# EAGLE design 16296 (EAGLE 7.6.0)
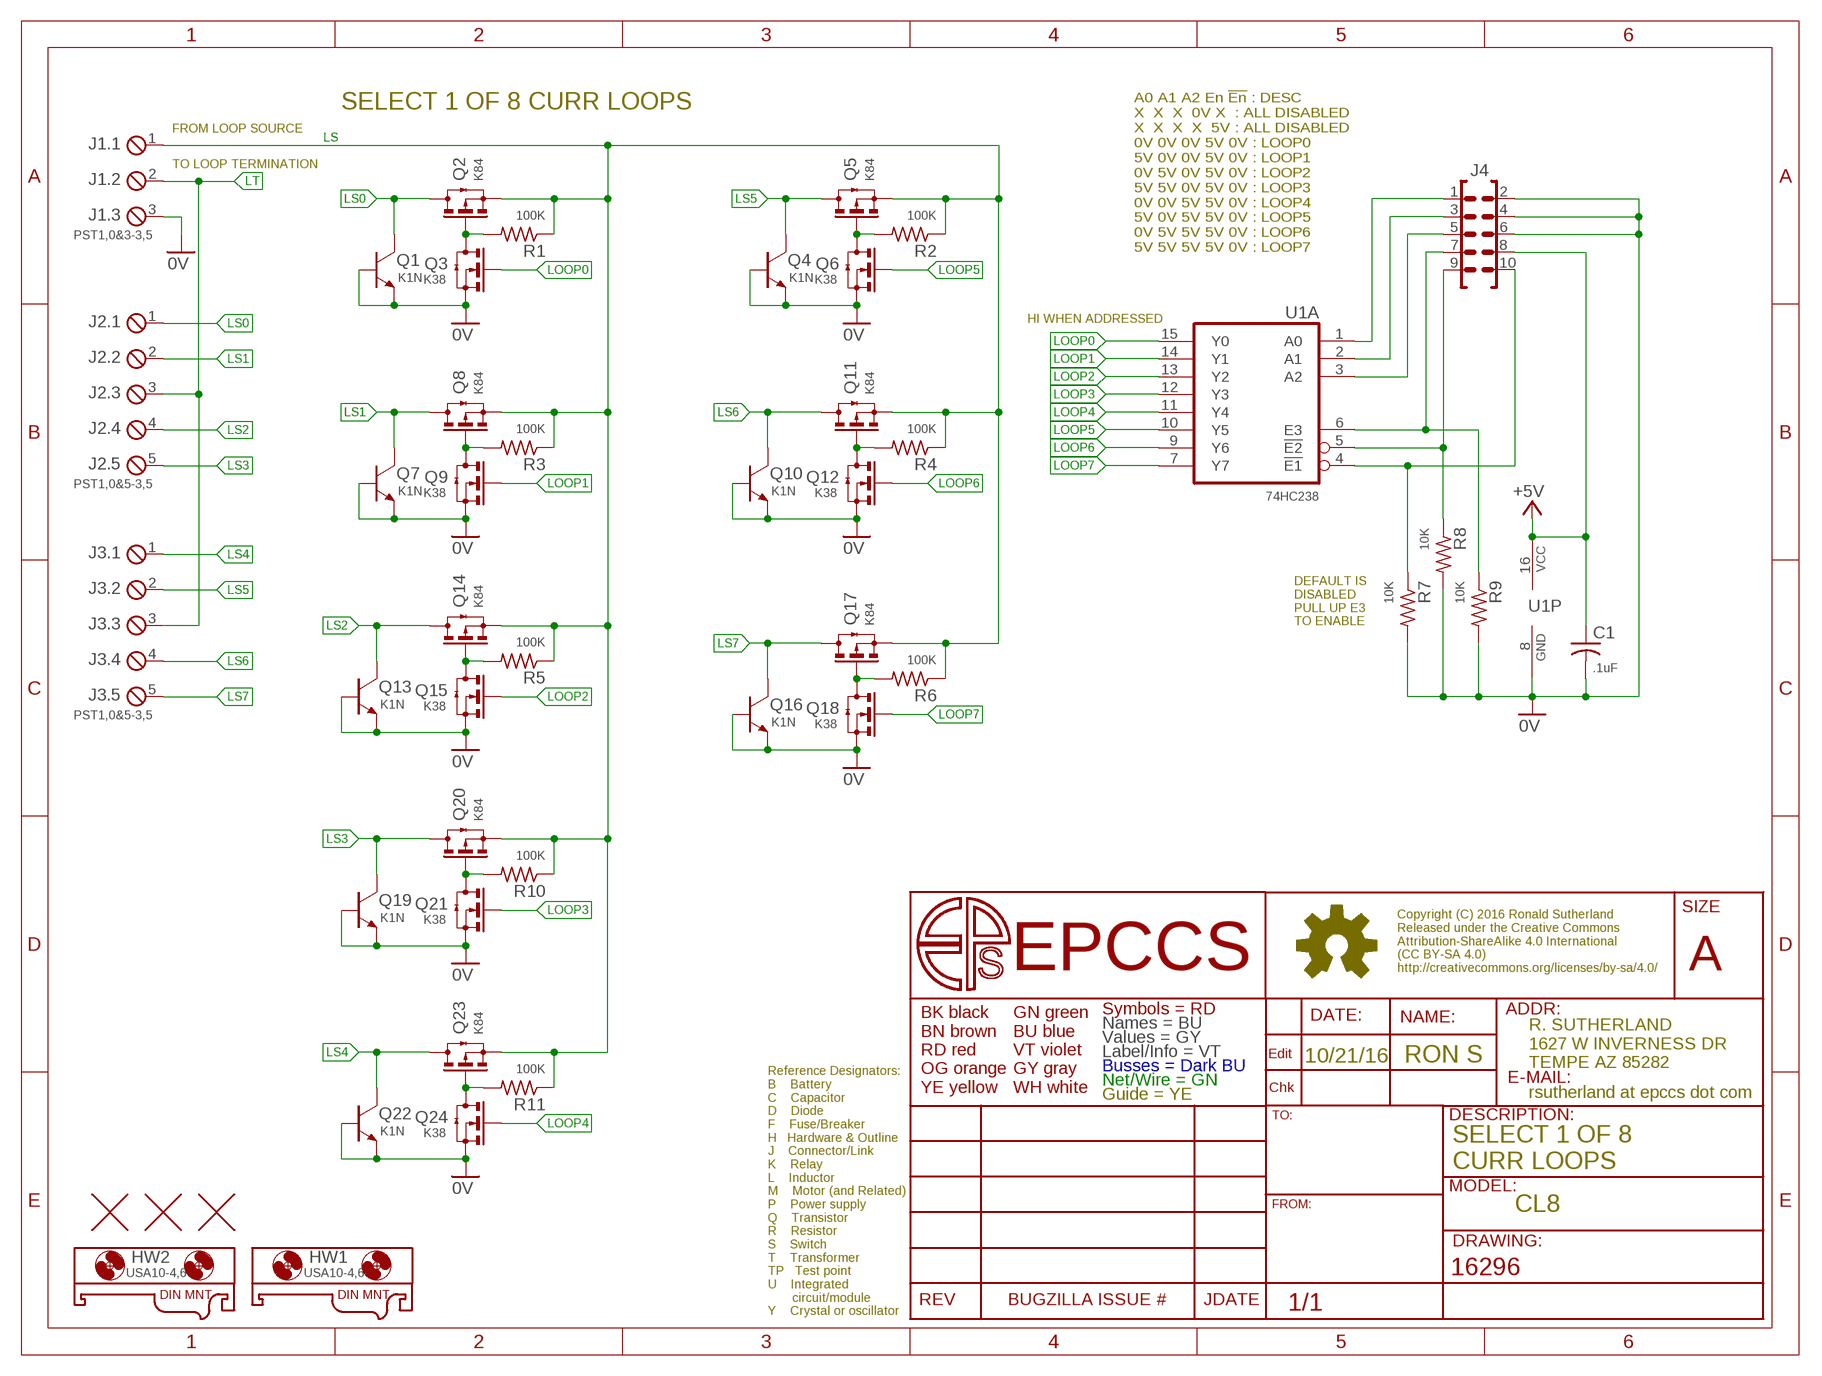
[diagram p0: schematic, sheet 1]

## Parts
C1  .1uF  CC0603A  [C0603(1608)]
HW1  USA10-4,6  MOUNT-HOLE5.0  [USA10]
HW2  USA10-4,6  MOUNT-HOLE5.0  [USA10]
J1  PST1,0&3-3,5  MCV3  [MCV3]
J2  PST1,0&5-3,5  MCV5  [MCV5]
J3  PST1,0&5-3,5  MCV5  [MCV5]
J4  2X5  [2X5]
Q1  K1N  NPNSOT23  [SOT23]
Q2  K84  N-CHSOT23  [SOT23]
Q3  K38  N-CHSOT23  [SOT23]
Q4  K1N  NPNSOT23  [SOT23]
Q5  K84  N-CHSOT23  [SOT23]
Q6  K38  N-CHSOT23  [SOT23]
Q7  K1N  NPNSOT23  [SOT23]
Q8  K84  N-CHSOT23  [SOT23]
Q9  K38  N-CHSOT23  [SOT23]
Q10  K1N  NPNSOT23  [SOT23]
Q11  K84  N-CHSOT23  [SOT23]
Q12  K38  N-CHSOT23  [SOT23]
Q13  K1N  NPNSOT23  [SOT23]
Q14  K84  N-CHSOT23  [SOT23]
Q15  K38  N-CHSOT23  [SOT23]
Q16  K1N  NPNSOT23  [SOT23]
Q17  K84  N-CHSOT23  [SOT23]
Q18  K38  N-CHSOT23  [SOT23]
Q19  K1N  NPNSOT23  [SOT23]
Q20  K84  N-CHSOT23  [SOT23]
Q21  K38  N-CHSOT23  [SOT23]
Q22  K1N  NPNSOT23  [SOT23]
Q23  K84  N-CHSOT23  [SOT23]
Q24  K38  N-CHSOT23  [SOT23]
R1  100K  R0805  [C0805(2012)]
R2  100K  R0805  [C0805(2012)]
R3  100K  R0805  [C0805(2012)]
R4  100K  R0805  [C0805(2012)]
R5  100K  R0805  [C0805(2012)]
R6  100K  R0805  [C0805(2012)]
R7  10K  R0805  [C0805(2012)]
R8  10K  R0805  [C0805(2012)]
R9  10K  R0805  [C0805(2012)]
R10  100K  R0805  [C0805(2012)]
R11  100K  R0805  [C0805(2012)]
U1  74HC238  74238D  [16SOIC]
U$2  FIDUCIAL1.27  [FIDUCIAL-1.27]
U$3  FIDUCIAL1.27  [FIDUCIAL-1.27]
U$4  FIDUCIAL1.27  [FIDUCIAL-1.27]

## Nets
0V: C1.2 J1.3 J4.2 J4.4 J4.6 Q1.B Q1.E Q3.2(S)(S) Q4.B Q4.E Q6.2(S)(S) Q7.B Q7.E Q9.2(S)(S) Q10.B Q10.E Q12.2(S)(S) Q13.B Q13.E Q15.2(S)(S) Q16.B Q16.E Q18.2(S)(S) Q19.B Q19.E Q21.2(S)(S) Q22.B Q22.E Q24.2(S)(S) R7.2 R8.2 R9.2 U1.8(P:GND)
!E1: J4.10 R7.1 U1.4(A:!E1)
!E2: J4.9 R8.1 U1.5(A:!E2)
+5V: C1.1 J4.8 U1.16(P:VCC)
A0: J4.1 U1.1(A:A0)
A1: J4.3 U1.2(A:A1)
A2: J4.5 U1.3(A:A2)
E3: J4.7 R9.1 U1.6(A:E3)
LOOP0: Q3.1(G)(G) U1.15(A:Y0)
LOOP1: Q9.1(G)(G) U1.14(A:Y1)
LOOP2: Q15.1(G)(G) U1.13(A:Y2)
LOOP3: Q21.1(G)(G) U1.12(A:Y3)
LOOP4: Q24.1(G)(G) U1.11(A:Y4)
LOOP5: Q6.1(G)(G) U1.10(A:Y5)
LOOP6: Q12.1(G)(G) U1.9(A:Y6)
LOOP7: Q18.1(G)(G) U1.7(A:Y7)
LS: J1.1 Q2.2(S)(S) Q5.2(S)(S) Q8.2(S)(S) Q11.2(S)(S) Q14.2(S)(S) Q17.2(S)(S) Q20.2(S)(S) Q23.2(S)(S) R1.1 R2.1 R3.1 R4.1 R5.1 R6.1 R10.1 R11.1
LS0: J2.1 Q1.C Q2.3(D)(D)
LS1: J2.2 Q7.C Q8.3(D)(D)
LS2: J2.4 Q13.C Q14.3(D)(D)
LS3: J2.5 Q19.C Q20.3(D)(D)
LS4: J3.1 Q22.C Q23.3(D)(D)
LS5: J3.2 Q4.C Q5.3(D)(D)
LS6: J3.4 Q10.C Q11.3(D)(D)
LS7: J3.5 Q16.C Q17.3(D)(D)
LT: J1.2 J2.3 J3.3
N$1: Q5.1(G)(G) Q6.3(D)(D) R2.2
N$2: Q8.1(G)(G) Q9.3(D)(D) R3.2
N$3: Q11.1(G)(G) Q12.3(D)(D) R4.2
N$4: Q14.1(G)(G) Q15.3(D)(D) R5.2
N$5: Q17.1(G)(G) Q18.3(D)(D) R6.2
N$6: Q20.1(G)(G) Q21.3(D)(D) R10.2
N$7: Q23.1(G)(G) Q24.3(D)(D) R11.2
N$78: Q2.1(G)(G) Q3.3(D)(D) R1.2

## Notes on the sheet
- SELECT 1 OF 8 CURR LOOPS
- FROM LOOP SOURCE
- TO LOOP TERMINATION
- A0 A1 A2 En !En! : DESC
  X  X  X  0V X  : ALL DISABLED
  X  X  X  X  5V : ALL DISABLED
  0V 0V 0V 5V 0V : LOOP0
  5V 0V 0V 5V 0V : LOOP1
  0V 5V 0V 5V 0V : LOOP2
  5V 5V 0V 5V 0V : LOOP3
  0V 0V 5V 5V 0V : LOOP4
  5V 0V 5V 5V 0V : LOOP5
  0V 5V 5V 5V 0V : LOOP6
  5V 5V 5V 5V 0V : LOOP7
- HI WHEN ADDRESSED
- DEFAULT IS
  DISABLED
  PULL UP E3
  TO ENABLE
- 10/21/16 | RON S
- SELECT 1 OF 8 
  CURR LOOPS
- CL8

## Library data of the parts
C1 = C-C:C: CAPACITOR Symbol
HW1 HW2 = HW-DINMnt:MOUNT-HOLE: USA10-4.6 [PhxCont,1202713] DINRAIL ADAPTER UNIVERSAL 10MM 4.6MM
J1 = J-HDR3.5mm:MCV3: MCV 1,5/ 3-G-3,5-RN [PHOENIX CONTACT,1731484] CONN HEADER SHROUDED 3POS 3.5MM MCVR 1,5/ 3-ST-3,5 [PHOENIX CONTACT,1863165] CONN PLUG 3POS SCREW 3.5MM PST 1,0/3-3,5 [PHOENIX CONTACT,1945106] CONN HEADER STRIP PIN 3POS 3.5MM PT1,5&3-PVH-3,5 [PHOENIX CONTACT,1984028] CONN PLUG STRIP 3POS 3.5MM
J2 J3 = J-HDR3.5mm:MCV5: MCV 1,5/5-G-3,5-RN [PHOENIX CONTACT,1843635] CONN HEADER SHROUDED 5POS 3.5MM MCVR 1,5/5-ST-3,5 [PHOENIX CONTACT,1863181] CONN PLUG 5POS SCREW 3.5MM PST 1,0/5-3,5 [PHOENIX CONTACT,1945122] CONN HEADER STRIP PIN 5POS 3.5MM PT 1,5/5-PVH-3,5 [PHOENIX CONTACT,1984044] CONN PLUG STRIP 4POS 3.5MM Drill Size 3/64": .0469" (1.2mm)
J4 = J-HDR2.54mm:2X5: 2 X 5 POS HEADER
Q1 Q4 Q7 Q10 Q13 Q16 Q19 Q22 = Q-NPN:NPN: BJT NPN General Purpose Amplifier
Q2 Q5 Q8 Q11 Q14 Q17 Q20 Q23 = Q-PCH:N-CH?*: ENHANCEMENT MODE MOSFET SOT23 is BSS138 pinout
Q3 Q6 Q9 Q12 Q15 Q18 Q21 Q24 = Q-NCH:N-CH?*: ENHANCEMENT MODE MOSFET SOT23 is BSS138 pinout
R1-R11 = R-C:R: Resiistor American-style symbol
U1 = U-7400:74*238: non-Inverting Logic 3- to 8-Line Decoder/Demultiplexer see 74138 for Inverting
U$2-U$4 = H-Fiducial:FIDUCIAL: Fiducial Alignment Points Various fiducial points for machine vision alignment.

## Net classes
0 default: width 0.254 mm, drill 0.33 mm

## Board
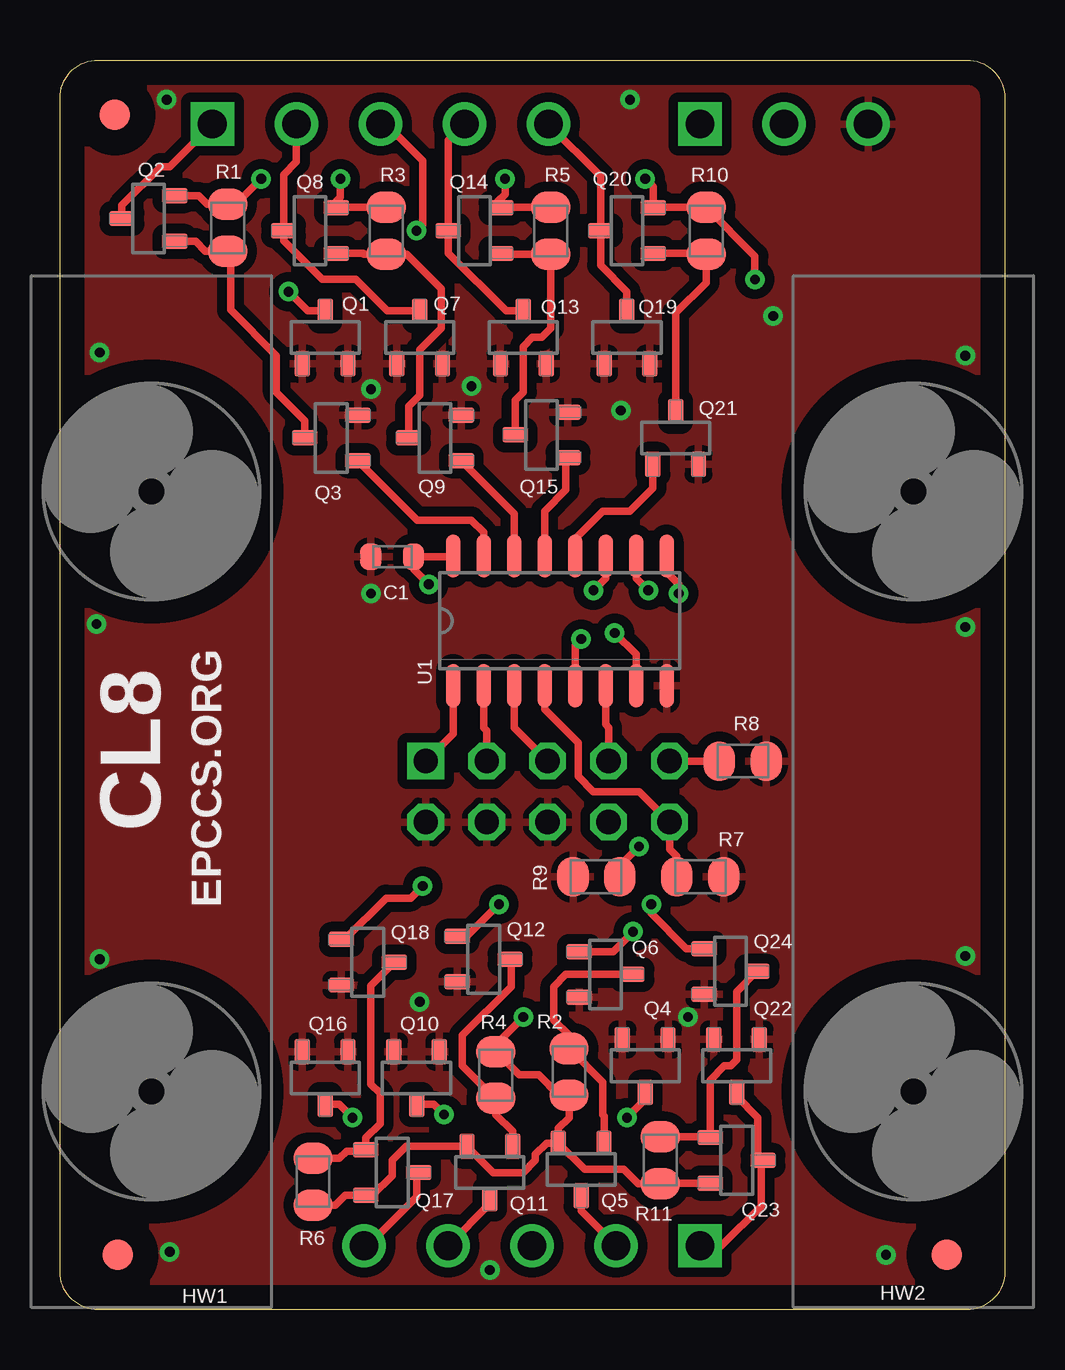
[diagram p1: board, top side]
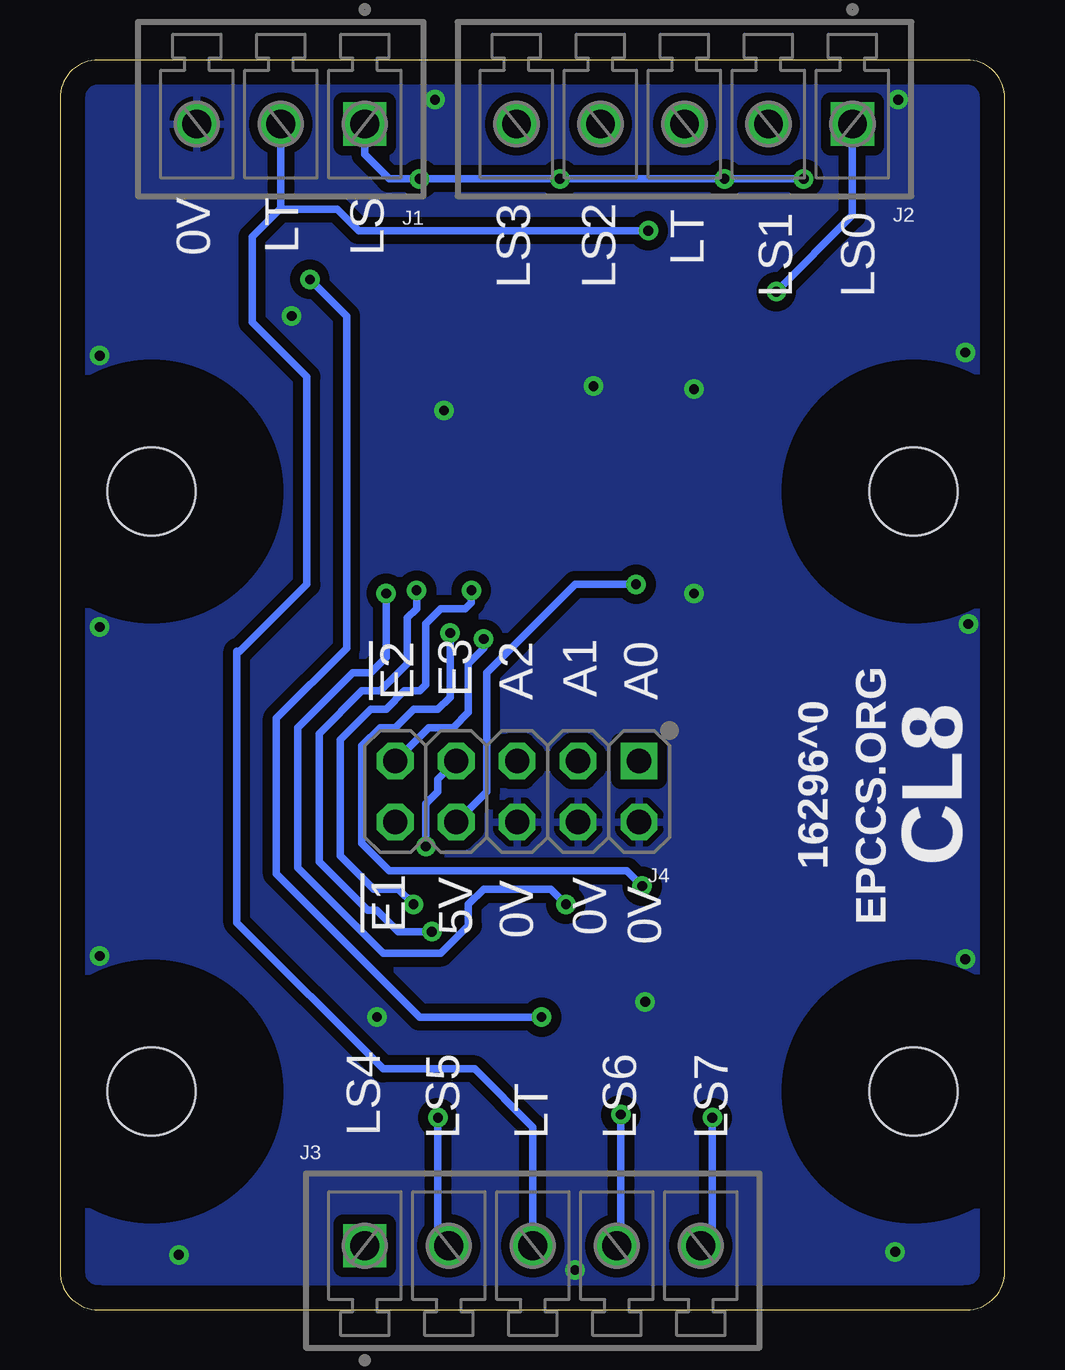
[diagram p2: board, bottom side, seen from below]

Size 39.37 x 52.07 mm. Coordinates in mm from the lower left corner, seen from the top.
Outline: 39.37,50.48 39.37,1.59 arc-90 37.78,0 1.59,0 arc-90 0,1.59 0,50.48 arc-90 1.59,52.07 37.78,52.07 arc-90 39.37,50.48
Copper layers (1*16): Top 0.034290625mm / dielectric 60mil / Bottom 0.034290625mm
Design rules "default *": minimum track width 10mil, minimum drill 13mil, track to track 12mil, track to pad 10mil, pad to pad 8mil, via to via 12mil, smd to smd 8mil, copper to edge 40mil, drill to drill 16mil, minimum pad ring 10mil, minimum via ring 8mil, stop-mask expansion 4mil, vias tented up to drill 17mil, thermal gap 10mil

### Footprints (pad centres in the part's own frame; a part is rotated, then mirrored left to right if it is on the bottom)
C0603(1608) = smd 0.898 x 1.1: 1 -0.889,0; 2 0.889,0
USA10 = hole 3.658: -12.5,0; 12.5,0
MCV3 = drill 1.2 square: 1 0,0 | drill 1.2: 2 3.5,0; 3 7,0
MCV5 = drill 1.2 square: 1 0,0 | drill 1.2: 2 3.5,0; 3 7,0; 4 10.5,0; 5 14,0
2X5 = drill 1.016 square: 1 0,0 | drill 1.016 octagon: 2 0,2.54; 3 2.54,0; 4 2.54,2.54; 5 5.08,0; 6 5.08,2.54; 7 7.62,0; 8 7.62,2.54; 9 10.16,0; 10 10.16,2.54
SOT23 = smd 0.65 x 1.06: B -0.95,-1.1; C 0,1.1; E 0.95,-1.1
SOT23' = smd 0.65 x 1.06: 1(G) -0.95,-1.1; 2(S) 0.95,-1.1; 3(D) 0,1.1
C0805(2012) = smd 1.321 x 1.651: 1 -0.977,0; 2 0.977,0
16SOIC = smd 0.6 x 1.8: 1 -4.445,-2.7; 2 -3.175,-2.7; 3 -1.905,-2.7; 4 -0.635,-2.7; 5 0.635,-2.7; 6 1.905,-2.7; 7 3.175,-2.7; 8 4.445,-2.7; 9 4.445,2.7; 10 3.175,2.7; 11 1.905,2.7; 12 0.635,2.7; 13 -0.635,2.7; 14 -1.905,2.7; 15 -3.175,2.7; 16 -4.445,2.7
FIDUCIAL-1.27 = smd 1.27 x 1.27: 1 0,0

### Placement (x,y rotation side)
C1  13.84,31.37 180 top
HW1  3.81,21.59 90 top
HW2  35.56,21.59 90 top
J1  26.67,49.4 180 bottom
J2  6.35,49.4 180 bottom
J3  26.67,2.67 0 bottom
J4  15.24,22.86 180 bottom
Q1  11.05,40.51 0 top
Q2  K84  [SOT23']  3.68,45.47 90 top
Q3  K38  [SOT23']  11.3,36.32 90 top
Q4  24.38,10.16 180 top
Q5  K84  [SOT23']  21.72,5.84 180 top
Q6  K38  [SOT23']  22.73,13.97 270 top
Q7  14.99,40.51 0 top
Q8  K84  [SOT23']  10.41,44.96 90 top
Q9  K38  [SOT23']  15.62,36.32 90 top
Q10  14.86,9.65 180 top
Q11  K84  [SOT23']  17.91,5.71 180 top
Q12  K38  [SOT23']  17.65,14.61 270 top
Q13  19.3,40.51 0 top
Q14  K84  [SOT23']  17.27,44.96 90 top
Q15  K38  [SOT23']  20.07,36.45 90 top
Q16  11.05,9.65 180 top
Q17  K84  [SOT23']  13.84,5.71 270 top
Q18  K38  [SOT23']  12.83,14.48 270 top
Q19  23.62,40.51 0 top
Q20  K84  [SOT23']  23.62,44.96 90 top
Q21  K38  [SOT23']  25.65,36.32 0 top
Q22  28.19,10.16 180 top
Q23  K84  [SOT23']  28.19,6.22 270 top
Q24  K38  [SOT23']  27.94,14.1 270 top
R1  6.99,45.09 270 top
R2  21.21,9.91 90 top
R3  13.59,44.96 270 top
R4  18.16,9.78 270 top
R5  20.45,44.96 270 top
R6  10.54,5.33 90 top
R7  26.67,18.03 0 top
R8  28.45,22.86 0 top
R9  22.35,18.03 180 top
R10  26.92,44.96 270 top
R11  25.02,6.22 90 top
U1  20.83,28.7 0 top
U$2  36.96,2.29 0 top
U$3  2.29,49.78 0 top
U$4  2.41,2.29 0 top

### Tracks (layer width: path | path; a pad name or v marks a point on that pad's centre or on a via)
0V  (via drill 0.41)
  other vias: 12.95,29.84 1.65,39.88 4.45,50.42 23.75,50.42 37.72,39.75 29.72,41.4 23.37,37.47 17.14,38.48 12.95,38.35 1.52,28.57 1.65,14.61 4.57,2.41 17.91,1.65 34.42,2.29 37.72,14.73 37.72,28.45 26.16,12.19 14.99,12.83
  pour Bottom (isolate 0.406): 0,52.07 39.37,52.07 39.37,0 0,0
  pour Top (isolate 0.406, rank 6): 0,52.07 39.37,52.07 39.37,0 0,0
!E1
  Top 0.305: U1.4 20.19,25.02 21.59,23.62 21.59,22.23 22.23,21.59 24.13,21.59 J4.10 25.4,19.18 25.69,18.88 R7.1
!E2  (via drill 0.41)
  Top 0.305: U1.5 21.46,27.69 v21.72,27.94 | R8.1 J4.9
  Bottom 0.305: v21.72,27.94 21.72,27.56 22.35,26.92 22.35,24.89 22.99,24.26 24,24.26 J4.9
+5V  (via drill 0.41)
  Top 0.305: v15.37,30.23 14.73,30.86 C1.1 16.35,31.37 U1.16
  Bottom 0.305: J4.8 21.59,21.59 21.59,26.54 17.91,30.23 v15.37,30.23
A0
  Top 0.305: U1.1 16.38,24 J4.1
A1
  Top 0.305: U1.2 17.65,24.26 17.78,24.13 J4.3
A2
  Top 0.305: U1.3 18.92,24.26 J4.5
E3  (via drill 0.41)
  Top 0.305: U1.6 22.73,24.38 22.86,24.26 J4.7 | v24.13,19.3 23.58,18.76 R9.1
  Bottom 0.305: J4.7 23.62,22.1 23.62,21.59 24.13,21.08 v24.13,19.3
LOOP0
  Top 0.305: U1.15 17.65,32.38 17.14,32.89 14.88,32.89 Q3.1(G)
LOOP1
  Top 0.305: U1.14 18.92,33.17 Q9.1(G)
LOOP2
  Top 0.305: U1.13 20.19,33.27 21.08,34.16 21.08,35.41 Q15.1(G)
LOOP3
  Top 0.305: U1.12 21.46,32.13 22.61,33.27 23.75,33.27 24.7,34.23 Q21.1(G)
LOOP4  (via drill 0.41)
  Top 0.305: U1.11 22.73,30.48 v22.23,29.97 | v24.64,16.89 24.64,16.51 26.1,15.05 Q24.1(G)
  Bottom 0.305: v22.23,29.97 22.23,29.46 22.48,29.21 23.5,29.21 24.13,28.57 24.13,26.04 24.38,25.78 25.02,25.78 25.78,25.02 26.42,25.02 27.69,23.75 27.69,18.92 26.29,17.53 25.27,17.53 v24.64,16.89
LOOP5  (via drill 0.41)
  Top 0.305: U1.10 24,30.48 v24.51,29.97 | v23.88,15.75 23.05,14.92 Q6.1(G)
  Bottom 0.305: v24.51,29.97 24.51,29.21 24.89,28.83 24.89,26.92 26.04,25.78 26.8,25.78 28.57,24 28.57,18.67 26.54,16.64 26.16,16.64 25.27,15.75 v23.88,15.75
LOOP6  (via drill 0.41)
  Top 0.305: U1.9 25.27,30.73 25.78,30.23 v25.78,29.84 | v18.29,16.89 16.95,15.55 Q12.1(G)
  Bottom 0.305: v25.78,29.84 25.78,27.18 26.42,26.54 27.18,26.54 29.46,24.26 29.46,18.41 25.91,14.86 23.5,14.86 22.35,16 22.35,16.89 21.72,17.53 18.92,17.53 v18.29,16.89
LOOP7  (via drill 0.41)
  Top 0.305: U1.7 24,27.3 v23.11,28.19 | Q18.1(G) 11.87,15.43 13.59,17.14 14.61,17.14 v15.11,17.65
  Bottom 0.305: v23.11,28.19 23.11,25.53 23.62,25.02 24.64,25.02 25.4,24.26 26.04,24.26 26.8,23.5 26.8,19.43 25.65,18.29 15.75,18.29 v15.11,17.65
LS  (via drill 0.41)
  Top 0.305: v24.38,47.12 24.72,46.78 Q20.2(S) 24.75,45.94 R10.1 28.96,43.9 v28.96,42.93 | v18.54,47.12 18.54,46.48 18.25,46.19 Q14.2(S) 18.27,45.94 R5.1 | v11.68,47.12 11.68,46.35 11.51,46.19 Q8.2(S) 11.54,45.94 R3.1 | Q2.2(S) 5.78,46.42 6.13,46.06 R1.1 7.33,46.06 v8.38,47.12 | Q23.2(S) 25.05,5.27 R11.1 24.09,5.25 23.5,5.84 21.87,5.84 Q5.2(S) | Q5.2(S) 20.28,6.94 19.81,6.48 19.81,6.22 19.3,5.71 18.06,5.71 Q11.2(S) 14.44,6.82 13.84,6.22 13.84,5.59 13.02,4.76 Q17.2(S) 11.88,4.76 11.47,4.36 R6.1 | Q5.2(S) 20.77,7.56 21.21,8 R2.1 20.79,8.93 19.94,9.78 19.14,9.78 R4.1 18.16,11.05 v19.3,12.19
  Bottom 0.305: v8.38,47.12 v11.68,47.12 v18.54,47.12 v24.38,47.12 25.65,47.12 26.67,48.13 J1.1 | v19.3,12.19 24.38,12.19 30.35,18.16 30.35,24.64 27.43,27.56 27.43,41.4 v28.96,42.93
LS0  (via drill 0.41)
  Top 0.305: Q1.C 10.33,41.61 v9.53,42.42 | Q2.3(D) 2.58,46.02 4.19,47.62 4.57,47.62 J2.1
  Bottom 0.305: v9.53,42.42 6.35,45.59 J2.1
LS1
  Top 0.305: Q7.C 13.63,41.61 12.32,42.93 10.92,42.93 9.31,44.53 Q8.3(D) 9.31,47.29 9.85,47.82 J2.2
LS2
  Top 0.305: Q13.C 18.59,41.61 16.17,44.03 Q14.3(D) 16.17,48.73 J2.4
LS3
  Top 0.305: Q19.C 23.62,42.42 22.52,43.52 Q20.3(D) 22.52,47.23 J2.5
LS4
  Top 0.305: Q22.C 28.19,8.89 29.08,8 29.08,6.43 Q23.3(D) 29.21,6.14 29.21,4.32 27.56,2.67 J3.1
LS5  (via drill 0.41)
  Top 0.305: Q4.C 24.38,8.76 v23.62,8 | Q5.3(D) 21.72,4.12 J3.2
  Bottom 0.305: v23.62,8 23.62,3.12 J3.2
LS6  (via drill 0.41)
  Top 0.305: Q10.C 15.58,8.55 v16,8.13 | Q11.3(D) 17.91,4.4 J3.4
  Bottom 0.305: v16,8.13 16,2.83 J3.4
LS7  (via drill 0.41)
  Top 0.305: J3.5 12.83,2.67 14.86,4.7 14.86,5.63 Q17.3(D) | Q16.C 11.64,8.55 v12.19,8
  Bottom 0.305: v12.19,8 12.19,3.15 J3.5
LT  (via drill 0.41)
  Top 0.305: J2.3 13.59,49.4 15.11,47.88 15.11,45.21 v14.86,44.96
  Bottom 0.305: J3.3 19.67,7.61 22.1,10.03 25.91,10.03 32,16.13 32,27.43 31.88,27.43 29.08,30.23 29.08,38.86 31.37,41.15 31.37,44.7 30.17,45.9 | J1.2 30.17,45.9 | v14.86,44.96 26.92,44.96 27.81,45.85 30.11,45.85 30.17,45.9
N$1
  Top 0.305: Q5.1(G) 22.67,8.07 22.61,8.13 22.61,9.49 R2.2 21.21,11.43 20.57,12.06 20.57,13.46 21.08,13.97 Q6.3(D)
N$2
  Top 0.305: Q9.3(D) 14.52,37.63 14.99,38.1 14.99,40.01 15.88,40.89 15.88,42.55 14.44,43.98 R3.2 12.66,43.98 12.63,44.01 Q8.1(G)
N$3
  Top 0.305: Q11.1(G) 18.86,7.43 18.16,8.13 R4.2 18.12,8.8 16.76,10.16 16.76,11.43 18.8,13.46 18.8,14.56 Q12.3(D)
N$4
  Top 0.305: Q14.1(G) 18.27,43.98 R5.2 20.45,40.89 20.07,40.51 19.68,40.51 19.3,40.13 19.3,38.23 18.97,37.89 Q15.3(D)
N$5
  Top 0.305: R6.2 11.64,6.31 11.94,6.6 12.68,6.6 Q17.1(G) 12.74,7.16 13.34,7.75 13.34,9.02 12.95,9.4 12.95,13.51 Q18.3(D)
N$6
  Top 0.305: Q21.3(D) 25.65,41.53 26.92,42.8 R10.2 26.9,44.01 Q20.1(G)
N$7
  Top 0.305: R11.2 27.07,7.2 Q23.1(G) 27.09,9.57 27.69,10.16 27.94,10.16 28.19,10.41 28.19,13.25 Q24.3(D)
N$78
  Top 0.305: Q3.3(D) 10.2,37.04 9.02,38.23 9.02,39.75 7.11,41.66 7.11,43.98 R1.2 6.06,44.11 5.65,44.52 Q2.1(G)

### Text on the board
tPlace: CL8 | EPCCS.ORG
bPlace: LS0 | LS1 | LT | LS2 | LS3 | LS | LT | 0V | EPCCS.ORG | A1 | E3 | CL8 | 16296^0 | A0 | A2 | !E2 | 0V | 0V | 0V | 5V | !E1 | LS7 | LS6 | LT | LS5 | LS4